# Altium schematic sheet Peripherals_1.SchDoc: PCB_Personal_Gif
size A4; DrawnBy: Ravi dusi; SheetNumber: 2; SheetTotal: 4
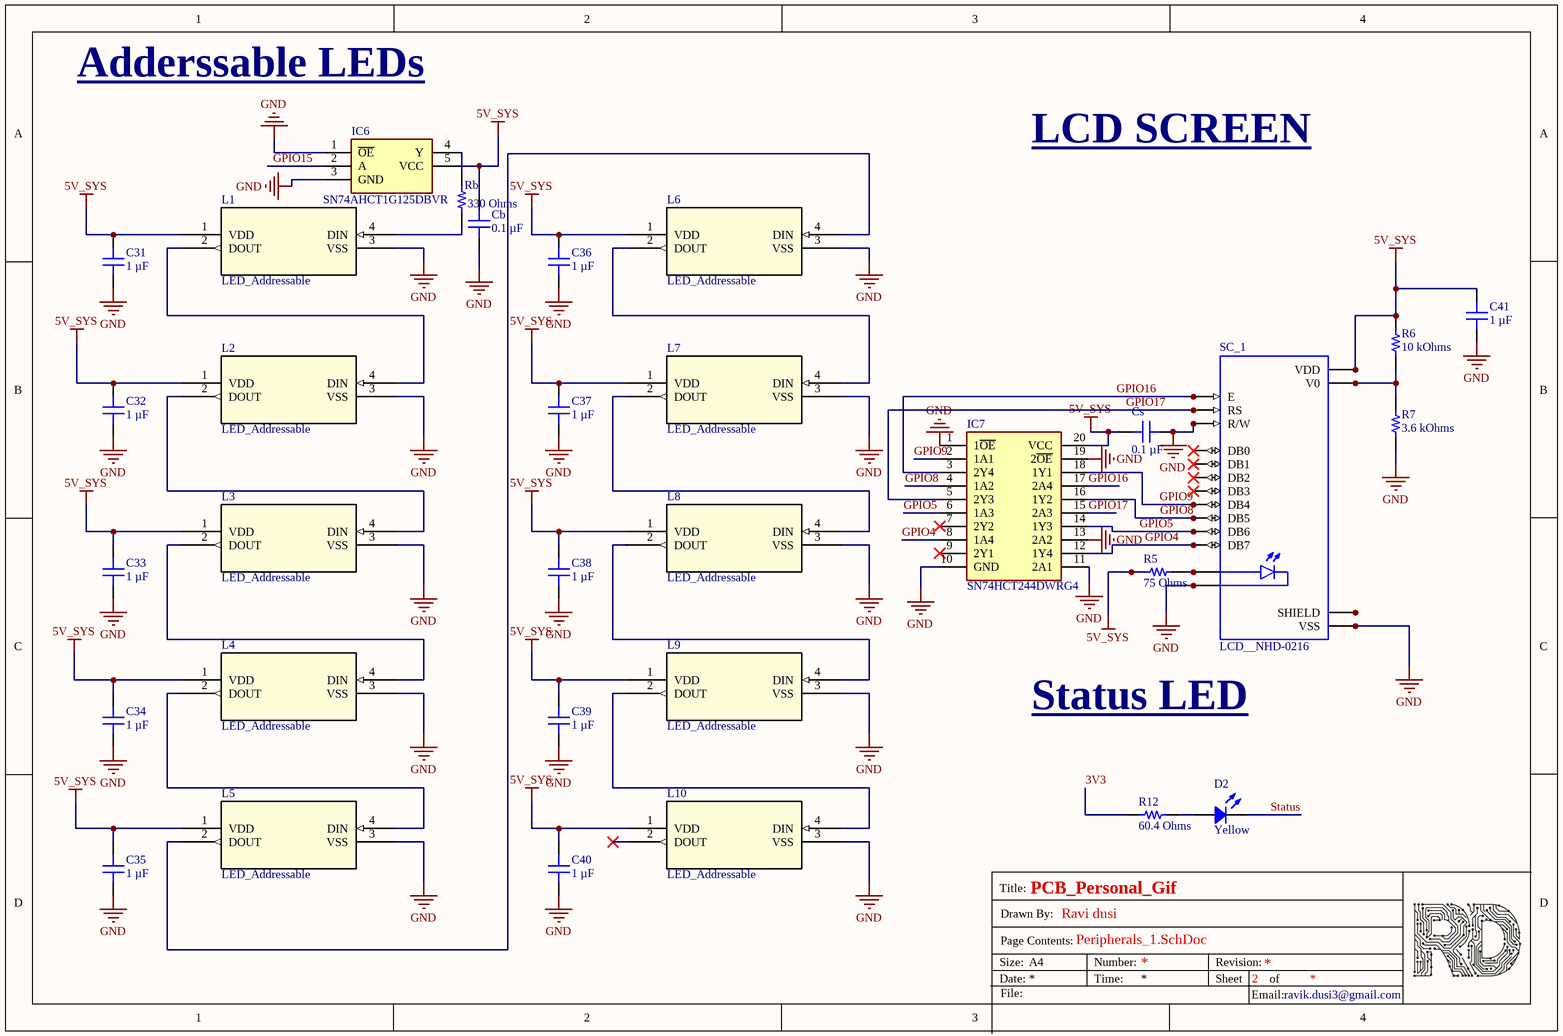
[diagram p0: Peripherals_1.SchDoc]

## Parts
C31  1 µF  [CAP 0402_1005]
C32  1 µF  [CAP 0402_1005]
C33  1 µF  [CAP 0402_1005]
C34  1 µF  [CAP 0402_1005]
C35  1 µF  [CAP 0402_1005]
C36  1 µF  [CAP 0402_1005]
C37  1 µF  [CAP 0402_1005]
C38  1 µF  [CAP 0402_1005]
C39  1 µF  [CAP 0402_1005]
C40  1 µF  [CAP 0402_1005]
C41  1 µF  [CAP 0402_1005]
Cb  0.1 µF  [CAP 0402_1005]
Cs  0.1 µF  [CAP 0402_1005]
D2  Yellow  [LED 1206_3216 YELLOW]
IC6  SN74AHCT1G125DBVR  [SOT95P280X145-5N]
IC7  SN74HCT244DWRG4  [SOIC127P1030X265-20N]
L1  LED_Addressable  [COM-16347_SPK]
L2  LED_Addressable  [COM-16347_SPK]
L3  LED_Addressable  [COM-16347_SPK]
L4  LED_Addressable  [COM-16347_SPK]
L5  LED_Addressable  [COM-16347_SPK]
L6  LED_Addressable  [COM-16347_SPK]
L7  LED_Addressable  [COM-16347_SPK]
L8  LED_Addressable  [COM-16347_SPK]
L9  LED_Addressable  [COM-16347_SPK]
L10  LED_Addressable  [COM-16347_SPK]
R5  75 Ohms  [RES 0402_1005]
R6  10 kOhms  [RES 0402_1005]
R7  3.6 kOhms  [RES 0402_1005]
R12  60.4 Ohms  [RES 0402_1005]
Rb  330 Ohms  [RES 0402_1005]
SC_1  LCD__NHD-0216  [NHD_NHD-0216K1Z-NSW-BBW-L]

## Nets
5V_SYS: C31.2 C32.2 C33.2 C34.2 C35.2 C36.2 C37.2 C38.2 C39.2 C40.2 C41.2 Cb.2 Cs.1 IC6.5(VCC) IC7.20(VCC) L1.1(VDD) L2.1(VDD) L3.1(VDD) L4.1(VDD) L5.1(VDD) L6.1(VDD) L7.1(VDD) L8.1(VDD) L9.1(VDD) L10.1(VDD) R5.1 R6.2 SC_1.2_1(VDD) SC_1.2_2(VDD)
GND: C31.1 C32.1 C33.1 C34.1 C35.1 C36.1 C37.1 C38.1 C39.1 C40.1 C41.1 Cb.1 Cs.2 IC6.1(~{OE}) IC6.3(GND) IC7.1(1~{OE}) IC7.10(GND) IC7.11(2A1) IC7.13(2A2) IC7.19(2~{OE}) L1.3(VSS) L2.3(VSS) L3.3(VSS) L4.3(VSS) L5.3(VSS) L6.3(VSS) L7.3(VSS) L8.3(VSS) L9.3(VSS) L10.3(VSS) R7.1 SC_1.1_1(VSS) SC_1.1_2(VSS) SC_1.5_1(R/W) SC_1.5_2(R/W) SC_1.16_1(LED-) SC_1.16_2(LED-)
3V3: R12.1
GPIO4: IC7.8(1A4) IC7.12(1Y4) SC_1.14_1(DB7) SC_1.14_2(DB7)
GPIO5: IC7.6(1A3) IC7.14(1Y3) SC_1.13_1(DB6) SC_1.13_2(DB6)
GPIO8: IC7.4(1A2) IC7.16(1Y2) SC_1.12_1(DB5) SC_1.12_2(DB5)
GPIO9: IC7.2(1A1) IC7.18(1Y1) SC_1.11_1(DB4) SC_1.11_2(DB4)
GPIO15: IC6.2(A)
GPIO16: IC7.3(2Y4) IC7.17(2A4) SC_1.6_1(E) SC_1.6_2(E)
GPIO17: IC7.5(2Y3) IC7.15(2A3) SC_1.4_1(RS) SC_1.4_2(RS)
Status: D2.2
NetD2_1: D2.1 R12.2
NetIC6_4: IC6.4(Y) Rb.2
NetL1_2: L1.2(DOUT) L2.4(DIN)
NetL1_4: L1.4(DIN) Rb.1
NetL2_2: L2.2(DOUT) L3.4(DIN)
NetL3_2: L3.2(DOUT) L4.4(DIN)
NetL4_2: L4.2(DOUT) L5.4(DIN)
NetL5_2: L5.2(DOUT) L6.4(DIN)
NetL6_2: L6.2(DOUT) L7.4(DIN)
NetL7_2: L7.2(DOUT) L8.4(DIN)
NetL8_2: L8.2(DOUT) L9.4(DIN)
NetL9_2: L9.2(DOUT) L10.4(DIN)
NetR5_2: R5.2 SC_1.15_1(LED+) SC_1.15_2(LED+)
NetR6_1: R6.1 R7.2 SC_1.3_1(V0) SC_1.3_2(V0)
NetSC_1_7_1: SC_1.7_1(DB0) SC_1.7_2(DB0)
NetSC_1_8_1: SC_1.8_1(DB1) SC_1.8_2(DB1)
NetSC_1_9_1: SC_1.9_1(DB2) SC_1.9_2(DB2)
NetSC_1_10_1: SC_1.10_1(DB3) SC_1.10_2(DB3)
NetSC_1_S1: SC_1.S1(SHIELD) SC_1.S2(SHIELD) SC_1.S3(SHIELD) SC_1.S4(SHIELD)

Not connected (* = marked no-connect by the designer): IC7 7(2Y2)* 9(2Y1)*; L10 2(DOUT)*

## Notes on the sheet
- Adderssable LEDs
- LCD SCREEN
- (near SC_1) Status LED
- Title:
- Drawn By:
- Size:
- Date:
- File:
- Page Contents:
- A4
- Number:
- Time:
- Revision:
- Sheet
- Email:
- of
- ravik.dusi3@gmail.com

## Library data of the parts
C31-C41 = GRM155C71A105KE11D: CAP CER 1UF 10V X7S 0402; manufacturer: Murata Electronics; Tolerance: ±10%; Part Number: GRM155C71A105KE11D; Value: 1 µF; Applications: General Purpose; Capacitance: 1 µF; componentlink1description: Datasheet; componentlink1url: https://search.murata.co.jp/Ceramy/image/img/A01X/G101/ENG/GRM155C71A105KE11-01.pdf; componentlink2description: DigiKey Link; componentlink2url: https://www.digikey.com/en/products/detail/murata-electronics/GRM155C71A105KE11D/6606086; Device Package: 0402 (1005 Metric); lastupdated: 09/02/2024 20:04:38; Lifecycle Status: Active; Minimum Order: 1; Mounting Type: Surface Mount, MLCC; Operating Temperature: -55°C ~ 125°C; Package / Case: 0402 (1005 Metric); packaging: TapeAndReel; partid: 1749; Part Status: Active; price: 0.01; series: GRM; Size / Dimension: 0.039" L x 0.020" W (1.00mm x 0.50mm); Supplier 1: DigiKey; Supplier Part Number 1: 490-14457-1-ND; Temperature Coefficient: X7S; Thickness (Max): 0.024" (0.60mm); Voltage - Rated: 10V
Cb Cs = C0402C104K4RECAUTO: CAP CER 0402 0.1UF 16V X7R 10%; manufacturer: KEMET; Part Number: C0402C104K4RECAUTO; Capacitance: 0.1 µF; Applications: Automotive, ESD Protection; componentlink1description: Datasheet; componentlink1url: https://api.kemet.com/component-edge/download/datasheet/C0402C104K4RECAUTO.pdf; componentlink2description: DigiKey Link; componentlink2url: https://www.digikey.com/en/products/detail/kemet/C0402C104K4RECAUTO/8563695; Device Package: 0402 (1005 Metric); lastupdated: 09-02-2024 20:04:38; Lifecycle Status: Active; Minimum Order: 1; Mounting Type: Surface Mount, MLCC; Operating Temperature: -55°C ~ 125°C; Package / Case: 0402 (1005 Metric); packaging: TapeAndReel; partid: 1731; Part Status: Active; price: 0.01; Ratings: AEC-Q200; series: ESD SMD Auto X7R; Size / Dimension: 0.039" L x 0.020" W (1.00mm x 0.50mm); Supplier 1: DigiKey; Supplier Part Number 1: 399-17167-1-ND; Temperature Coefficient: X7R; Thickness (Max): 0.022" (0.55mm); Tolerance: ±10%; value: 0.1 µF; Voltage - Rated: 16V
D2 = 5990240007F: LED YELLOW 1206 SMD; Manufacturer: Dialight; Configuration: Standard; Current - Test: 20mA; Lens Color: 0.80mm; Lens Size: 2.00mm x 1.60mm; Lens Style: Rectangle with Flat Top; Millicandela Rating: 126mcd; Viewing Angle: 140°; Voltage - Forward (Vf) (Typ): 2.1V; Wavelength - Dominant: 590nm; Part Number: 5990240007F; Color: Yellow; ComponentLink1Description: Datasheet; ComponentLink1URL: http://www.dialightsignalsandcomponents.com/Assets/Brochures_And_Catalogs/Indication/CBI_SMD_new/Dialight_CBI_data_599-1206_Apr2018.pdf; ComponentLink2Description: DigiKey Link; ComponentLink2URL: https://www.digikey.com/en/products/detail/dialight/5990240007F/9385418; Device Package: 1206 (3216 Metric); Height (Max): 0.80mm; LastUpdated: 03/06/2024 20:01:38; Lifecycle Status: Active; Minimum Order: 1; Mounting Type: Surface Mount; Package / Case: 1206 (3216 Metric); Packaging: TapeAndReel; PartId: 1; Part Status: Active; Price: 0.04; Series: 599; Size / Dimension: 3.20mm L x 1.60mm W; Supplier 1: DigiKey; Supplier Part Number 1: 350-4363-1-ND; Supplier Device Package: 1206; Value: Yellow
IC6 = SN74AHCT1G125DBVR: Integrated Circuit; Manufacturer_Name: Texas Instruments; Datasheet Link: http://www.ti.com/lit/ds/symlink/sn74ahct1g125.pdf; Height: 1.45mm; Manufacturer_Part_Number: SN74AHCT1G125DBVR; Mouser Part Number: 595-SNAHCT1G125DBVR; Mouser Price/Stock: https://www.mouser.co.uk/ProductDetail/Texas-Instruments/SN74AHCT1G125DBVR?qs=N6WZOzgtpqVaVW8Lh%252BgevA%3D%3D; Arrow Part Number: SN74AHCT1G125DBVR; Arrow Price/Stock: https://www.arrow.com/en/products/sn74ahct1g125dbvr/texas-instruments?utm_currency=USD&region=nac
IC7 = SN74HCT244DWRG4: Integrated Circuit; Manufacturer_Name: Texas Instruments; Datasheet Link: https://www.ti.com/general/docs/suppproductinfo.tsp?distId=10&gotoUrl=https%3A%2F%2Fwww.ti.com%2Flit%2Fgpn%2Fsn74hct244; Height: 2.65mm; Manufacturer_Part_Number: SN74HCT244DWRG4; Mouser Part Number: 595-SN74HCT244DWRG4; Mouser Price/Stock: https://www.mouser.co.uk/ProductDetail/Texas-Instruments/SN74HCT244DWRG4?qs=XQzc%252BbSrk5%252BkrjJHsjpLYg%3D%3D; Arrow Part Number: SN74HCT244DWRG4; Arrow Price/Stock: https://www.arrow.com/en/products/sn74hct244dwrg4/texas-instruments?utm_currency=USD&region=nac
R5 = ERJ-2GEJ750X: RES SMD 75 OHM 5% 1/10W 0402; Manufacturer: Panasonic Electronic Components; Power (Watts): 0.1W, 1/10W; Temperature Coefficient: ±200ppm/°C; Part Number: ERJ-2GEJ750X; Value: 75 Ohms; ComponentLink1Description: Datasheet; ComponentLink1URL: https://b2b-api.panasonic.eu/file_stream/pids/fileversion/1242; ComponentLink2Description: DigiKey Link; ComponentLink2URL: https://www.digikey.com/en/products/detail/panasonic-electronic-components/ERJ-2GEJ750X/147072; Composition: Thick Film; Device Package: 0402 (1005 Metric); Features: Automotive AEC-Q200; Height - Seated (Max): 0.016" (0.40mm); LastUpdated: 09/02/2024 20:30:20; Lifecycle Status: Active; Minimum Order: 1; Number of Terminations: 2; Operating Temperature: -55°C ~ 155°C; Package / Case: 0402 (1005 Metric); Packaging: CutTape; PartId: 3537; Part Status: Active; Price: 0.01; Ratings: AEC-Q200; Resistance: 75 Ohms; Series: ERJ-2G; Size / Dimension: 0.039" L x 0.020" W (1.00mm x 0.50mm); Supplier 1: DigiKey; Supplier Part Number 1: P75JCT-ND; Supplier Device Package: 0402; Tolerance: ±5%
R6 = RP73PF1E10KBTD: RES 10K OHM 0.1% 1/10W 0402; Manufacturer: TE Connectivity Passive Product; Power (Watts): 0.1W, 1/10W; Temperature Coefficient: ±25ppm/°C; Part Number: RP73PF1E10KBTD; Value: 10 kOhms; ComponentLink1Description: Datasheet; ComponentLink1URL: https://www.te.com/commerce/DocumentDelivery/DDEController?Action=srchrtrv&DocNm=1773272&DocType=DS&DocLang=English; ComponentLink2Description: DigiKey Link; ComponentLink2URL: https://www.digikey.com/en/products/detail/te-connectivity-passive-product/RP73PF1E10KBTD/8260957; Composition: Thin Film; Device Package: 0402 (1005 Metric); Height - Seated (Max): 0.014" (0.35mm); LastUpdated: 09/02/2024 20:30:24; Lifecycle Status: Active; Minimum Order: 1; Number of Terminations: 2; Operating Temperature: -55°C ~ 155°C; Package / Case: 0402 (1005 Metric); Packaging: TapeAndReel; PartId: 2434; Part Status: Active; Price: 0.08; Resistance: 10 kOhms; Series: RP73, Holsworthy; Size / Dimension: 0.039" L x 0.020" W (1.00mm x 0.50mm); Supplier 1: DigiKey; Supplier Part Number 1: A127415CT-ND; Supplier Device Package: 0402; Tolerance: ±0.1%
R7 = RC0402FR-073K6L: RES 3.6K OHM 1% 1/16W 0402; Manufacturer: Yageo; Power (Watts): 0.063W, 1/16W; Temperature Coefficient: ±100ppm/°C; Part Number: RC0402FR-073K6L; Value: 3.6 kOhms; ComponentLink1Description: Datasheet; ComponentLink1URL: https://www.yageo.com/upload/media/product/productsearch/datasheet/rchip/PYu-RC_Group_51_RoHS_L_10.pdf; ComponentLink2Description: DigiKey Link; ComponentLink2URL: https://www.digikey.com/en/products/detail/yageo/RC0402FR-073K6L/2827641; Composition: Thick Film; Device Package: 0402 (1005 Metric); Features: Moisture Resistant; Height - Seated (Max): 0.016" (0.40mm); LastUpdated: 09/02/2024 20:30:23; Lifecycle Status: Active; Minimum Order: 1; Number of Terminations: 2; Operating Temperature: -55°C ~ 155°C; Package / Case: 0402 (1005 Metric); Packaging: CutTape; PartId: 2730; Part Status: Active; Price: 0.01; Resistance: 3.6 kOhms; Series: RC_L; Size / Dimension: 0.039" L x 0.020" W (1.00mm x 0.50mm); Supplier 1: DigiKey; Supplier Part Number 1: 311-3.6KLRCT-ND; Supplier Device Package: 0402; Tolerance: ±1%
R12 = RT0402BRD0760R4L: RES SMD 60.4 OHM 0.1% 1/16W 0402; Manufacturer: Yageo; Power (Watts): 0.063W, 1/16W; Temperature Coefficient: ±25ppm/°C; Part Number: RT0402BRD0760R4L; Value: 60.4 Ohms; ComponentLink1Description: Datasheet; ComponentLink1URL: https://www.yageo.com/upload/media/product/productsearch/datasheet/rchip/PYu-RT_1-to-0.01_RoHS_L_11.pdf; ComponentLink2Description: DigiKey Link; ComponentLink2URL: https://www.digikey.com/en/products/detail/yageo/RT0402BRD0760R4L/1069349; Composition: Thin Film; Device Package: 0402 (1005 Metric); Height - Seated (Max): 0.014" (0.35mm); LastUpdated: 09/02/2024 20:30:16; Lifecycle Status: Active; Minimum Order: 1; Number of Terminations: 2; Operating Temperature: -55°C ~ 155°C; Package / Case: 0402 (1005 Metric); Packaging: TapeAndReel; PartId: 4533; Part Status: Active; Price: 0.04; Resistance: 60.4 Ohms; Series: RT; Size / Dimension: 0.039" L x 0.020" W (1.00mm x 0.50mm); Supplier 1: DigiKey; Supplier Part Number 1: YAG4293CT-ND; Supplier Device Package: 0402; Tolerance: ±0.1%
Rb = CPF0402B330RE1: RES SMD 330 OHM 0.1% 1/16W 0402; Manufacturer: TE Connectivity Passive Product; Power (Watts): 0.063W, 1/16W; Temperature Coefficient: ±25ppm/°C; Part Number: CPF0402B330RE1; Value: 330 Ohms; ComponentLink1Description: Datasheet; ComponentLink1URL: https://www.te.com/commerce/DocumentDelivery/DDEController?Action=srchrtrv&DocNm=1773200&DocType=DS&DocLang=English; ComponentLink2Description: DigiKey Link; ComponentLink2URL: https://www.digikey.com/en/products/detail/te-connectivity-passive-product/CPF0402B330RE1/2381792; Composition: Thin Film; Device Package: 0402 (1005 Metric); Height - Seated (Max): 0.014" (0.35mm); LastUpdated: 09-02-2024 20:30:20; Lifecycle Status: Active; Minimum Order: 1; Number of Terminations: 2; Operating Temperature: -55°C ~ 155°C; Package / Case: 0402 (1005 Metric); Packaging: TapeAndReel; PartId: 3357; Part Status: Active; Price: 0.13; Resistance: 330 Ohms; Series: CPF, Neohm; Size / Dimension: 0.039" L x 0.020" W (1.00mm x 0.50mm); Supplier 1: DigiKey; Supplier Part Number 1: A102797CT-ND; Supplier Device Package: 0402; Tolerance: ±0.1%
SC_1 = LCD__NHD-0216: Character Liquid Crystal Display Module.+5.0V INPUT Power